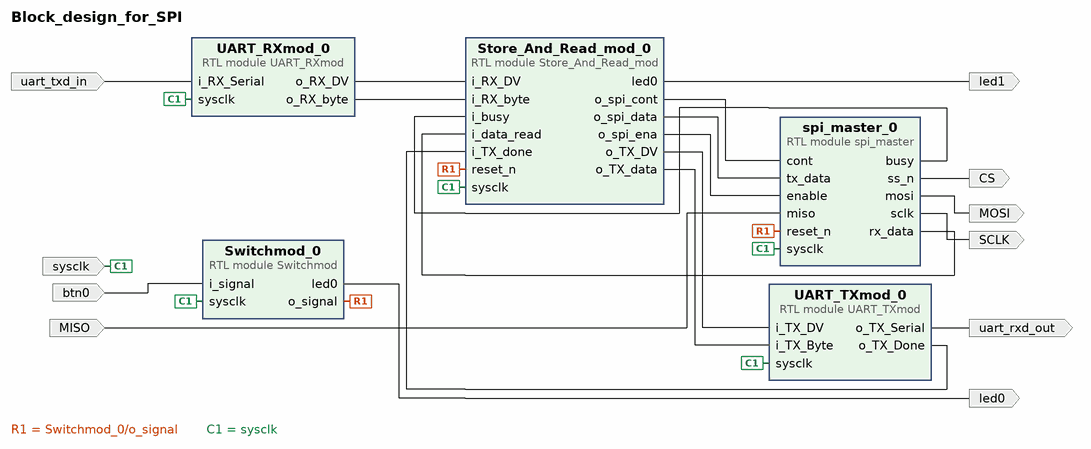
[diagram p0: block diagram of the top level]
# Vivado block design Block_design_for_SPI, xc7a35tcpg236-1, Vivado 2024.2
create_bd_design Block_design_for_SPI

create_bd_port -dir I btn0
create_bd_port -dir I sysclk
create_bd_port -dir O SCLK
create_bd_port -dir O CS
create_bd_port -dir O MOSI
create_bd_port -dir I MISO
create_bd_port -dir O led0
create_bd_port -dir O uart_rxd_out
create_bd_port -dir I uart_txd_in
create_bd_port -dir O led1

create_bd_cell -type module -reference spi_master spi_master_0
create_bd_cell -type module -reference Switchmod Switchmod_0
create_bd_cell -type module -reference Store_And_Read_mod Store_And_Read_mod_0
create_bd_cell -type module -reference UART_RXmod UART_RXmod_0
create_bd_cell -type module -reference UART_TXmod UART_TXmod_0

# ---- connections ----

connect_bd_net [get_bd_pins Store_And_Read_mod_0/led0] [get_bd_ports led1]
connect_bd_net [get_bd_pins Store_And_Read_mod_0/o_TX_DV] [get_bd_pins UART_TXmod_0/i_TX_DV]
connect_bd_net [get_bd_pins Store_And_Read_mod_0/o_TX_data] [get_bd_pins UART_TXmod_0/i_TX_Byte]
connect_bd_net [get_bd_pins Store_And_Read_mod_0/o_spi_cont] [get_bd_pins spi_master_0/cont]
connect_bd_net [get_bd_pins Store_And_Read_mod_0/o_spi_data] [get_bd_pins spi_master_0/tx_data]
connect_bd_net [get_bd_pins Store_And_Read_mod_0/o_spi_ena] [get_bd_pins spi_master_0/enable]
connect_bd_net [get_bd_pins Switchmod_0/led0] [get_bd_ports led0]
connect_bd_net [get_bd_pins Switchmod_0/o_signal] [get_bd_pins spi_master_0/reset_n] [get_bd_pins Store_And_Read_mod_0/reset_n]
connect_bd_net [get_bd_pins UART_RXmod_0/o_RX_DV] [get_bd_pins Store_And_Read_mod_0/i_RX_DV]
connect_bd_net [get_bd_pins UART_RXmod_0/o_RX_byte] [get_bd_pins Store_And_Read_mod_0/i_RX_byte]
connect_bd_net [get_bd_pins UART_TXmod_0/o_TX_Done] [get_bd_pins Store_And_Read_mod_0/i_TX_done]
connect_bd_net [get_bd_pins UART_TXmod_0/o_TX_Serial] [get_bd_ports uart_rxd_out]
connect_bd_net -net i_RX_Serial_0_1 [get_bd_ports uart_txd_in] [get_bd_pins UART_RXmod_0/i_RX_Serial]
connect_bd_net -net i_signal_0_1 [get_bd_ports btn0] [get_bd_pins Switchmod_0/i_signal]
connect_bd_net -net miso_0_1 [get_bd_ports MISO] [get_bd_pins spi_master_0/miso]
connect_bd_net [get_bd_pins spi_master_0/busy] [get_bd_pins Store_And_Read_mod_0/i_busy]
connect_bd_net [get_bd_pins spi_master_0/mosi] [get_bd_ports MOSI]
connect_bd_net [get_bd_pins spi_master_0/rx_data] [get_bd_pins Store_And_Read_mod_0/i_data_read]
connect_bd_net [get_bd_pins spi_master_0/sclk] [get_bd_ports SCLK]
connect_bd_net [get_bd_pins spi_master_0/ss_n] [get_bd_ports CS]
connect_bd_net -net sysclk_0_1 [get_bd_ports sysclk] \
  [get_bd_pins Switchmod_0/sysclk] [get_bd_pins spi_master_0/sysclk] [get_bd_pins UART_TXmod_0/sysclk] \
  [get_bd_pins UART_RXmod_0/sysclk] [get_bd_pins Store_And_Read_mod_0/sysclk]

validate_bd_design
save_bd_design
